# Altium schematic sheet STM32_MPU_IOs.SchDoc: MPU
size A3; SheetNumber: 3; SheetTotal: 7
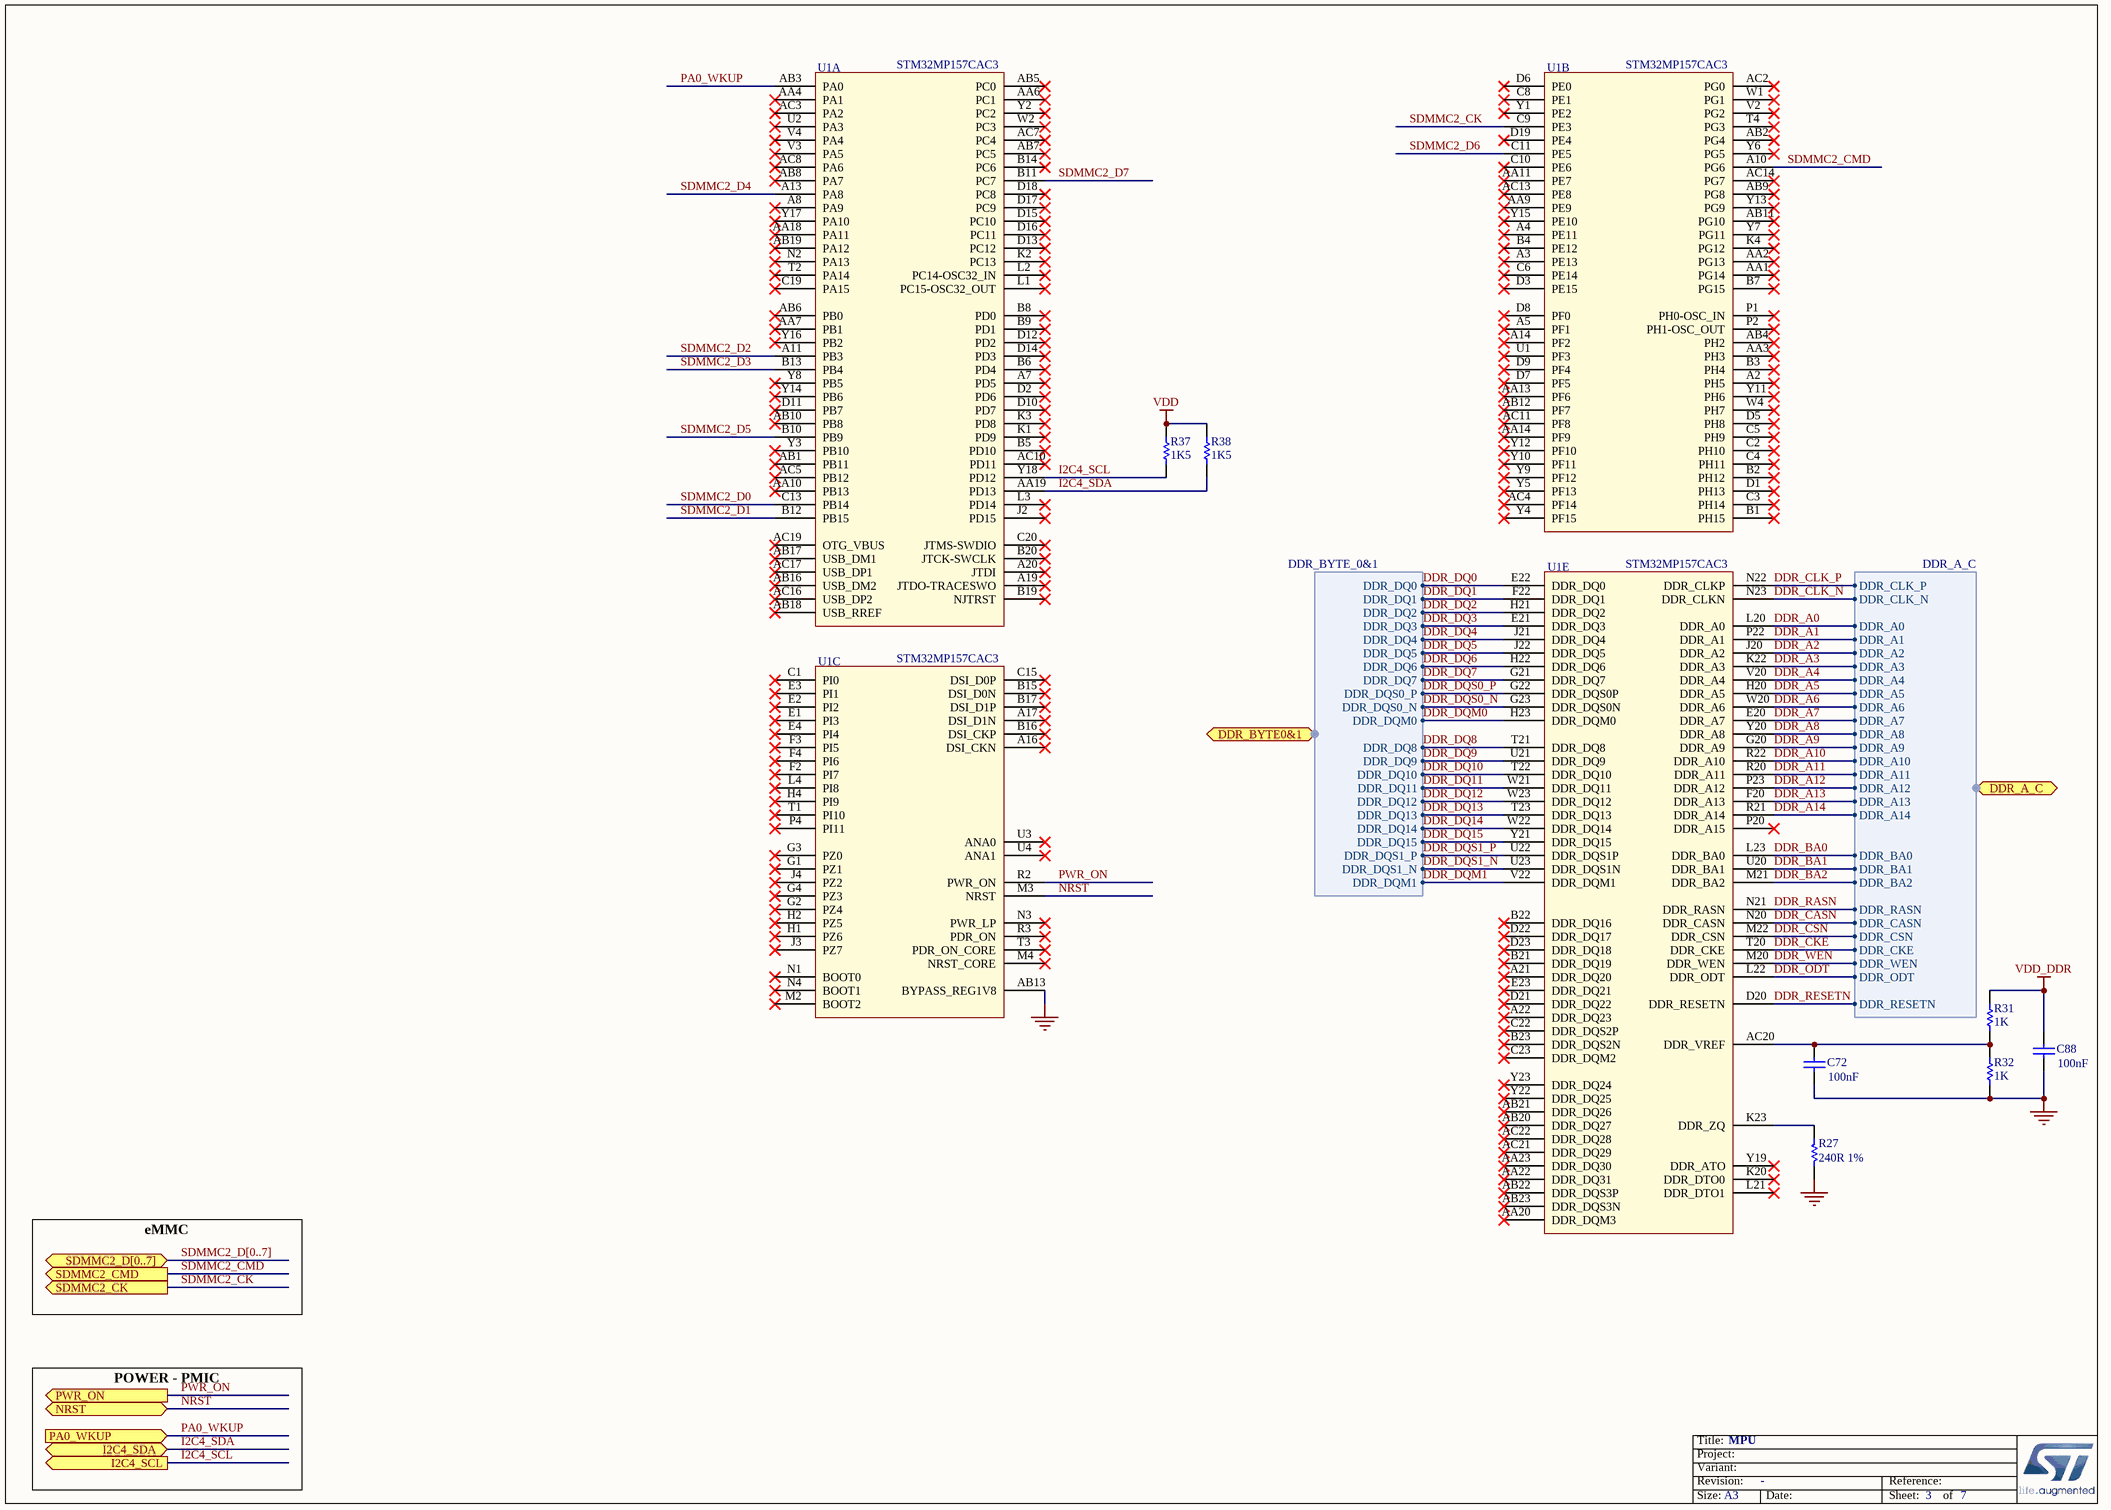
[diagram p0: STM32_MPU_IOs.SchDoc]

## Parts
C72  value 100nF  [C0402]
C88  value 100nF  [C0402]
R27  value 240R 1%  [R0402]
R31  value 1K  [R0402]
R32  value 1K  [R0402]
R37  value 1K5  [R0402]
R38  value 1K5  [R0402]
U1  value STM32MP157CAC3  [ICC_TFBGA361_12X12_STM32MP157CAC3_P050-065]  (parts A,B,C,E of 5)

## Ports
DDR_A_C (harness DDR_A_C), DDR_BYTE0&1 (harness DDR_BYTE_0&1), I2C4_SCL (out), I2C4_SDA (bidir), NRST (bidir), PA0_WKUP (in), PWR_ON (out), SDMMC2_CK (out), SDMMC2_CMD (out), SDMMC2_D[0..7] (bidir)

## Harnesses
DDR_BYTE_0&1: DDR_DQ0, DDR_DQ1, DDR_DQ2, DDR_DQ3, DDR_DQ4, DDR_DQ5, DDR_DQ6, DDR_DQ7, DDR_DQS0_P, DDR_DQS0_N, DDR_DQM0, DDR_DQ8, DDR_DQ9, DDR_DQ10, DDR_DQ11, DDR_DQ12, DDR_DQ13, DDR_DQ14, DDR_DQ15, DDR_DQS1_P, DDR_DQS1_N, DDR_DQM1
DDR_A_C: DDR_CLK_P, DDR_CLK_N, DDR_A0, DDR_A1, DDR_A2, DDR_A3, DDR_A4, DDR_A5, DDR_A6, DDR_A7, DDR_A8, DDR_A9, DDR_A10, DDR_A11, DDR_A12, DDR_A13, DDR_A14, DDR_BA0, DDR_BA1, DDR_BA2, DDR_RASN, DDR_CASN, DDR_CSN, DDR_CKE, DDR_WEN, DDR_ODT, DDR_RESETN

## Nets
GND: C72.1 C88.1 R27.2 R32.1 U1.AB13(BYPASS_REG1V8)
VDD: R37.1 R38.1
VDD_DDR: C88.2 R31.2
DDR_A0: U1.L20(DDR_A0) ; port DDR_A_C.DDR_A0
DDR_A1: U1.P22(DDR_A1) ; port DDR_A_C.DDR_A1
DDR_A2: U1.J20(DDR_A2) ; port DDR_A_C.DDR_A2
DDR_A3: U1.K22(DDR_A3) ; port DDR_A_C.DDR_A3
DDR_A4: U1.V20(DDR_A4) ; port DDR_A_C.DDR_A4
DDR_A5: U1.H20(DDR_A5) ; port DDR_A_C.DDR_A5
DDR_A6: U1.W20(DDR_A6) ; port DDR_A_C.DDR_A6
DDR_A7: U1.E20(DDR_A7) ; port DDR_A_C.DDR_A7
DDR_A8: U1.Y20(DDR_A8) ; port DDR_A_C.DDR_A8
DDR_A9: U1.G20(DDR_A9) ; port DDR_A_C.DDR_A9
DDR_A10: U1.R22(DDR_A10) ; port DDR_A_C.DDR_A10
DDR_A11: U1.R20(DDR_A11) ; port DDR_A_C.DDR_A11
DDR_A12: U1.P23(DDR_A12) ; port DDR_A_C.DDR_A12
DDR_A13: U1.F20(DDR_A13) ; port DDR_A_C.DDR_A13
DDR_A14: U1.R21(DDR_A14) ; port DDR_A_C.DDR_A14
DDR_BA0: U1.L23(DDR_BA0) ; port DDR_A_C.DDR_BA0
DDR_BA1: U1.U20(DDR_BA1) ; port DDR_A_C.DDR_BA1
DDR_BA2: U1.M21(DDR_BA2) ; port DDR_A_C.DDR_BA2
DDR_CASN: U1.N20(DDR_CASN) ; port DDR_A_C.DDR_CASN
DDR_CKE: U1.T20(DDR_CKE) ; port DDR_A_C.DDR_CKE
DDR_CLK_N: U1.N23(DDR_CLKN) ; port DDR_A_C.DDR_CLK_N
DDR_CLK_P: U1.N22(DDR_CLKP) ; port DDR_A_C.DDR_CLK_P
DDR_CSN: U1.M22(DDR_CSN) ; port DDR_A_C.DDR_CSN
DDR_DQ0: U1.E22(DDR_DQ0) ; port DDR_BYTE0&1.DDR_DQ0
DDR_DQ1: U1.F22(DDR_DQ1) ; port DDR_BYTE0&1.DDR_DQ1
DDR_DQ2: U1.H21(DDR_DQ2) ; port DDR_BYTE0&1.DDR_DQ2
DDR_DQ3: U1.E21(DDR_DQ3) ; port DDR_BYTE0&1.DDR_DQ3
DDR_DQ4: U1.J21(DDR_DQ4) ; port DDR_BYTE0&1.DDR_DQ4
DDR_DQ5: U1.J22(DDR_DQ5) ; port DDR_BYTE0&1.DDR_DQ5
DDR_DQ6: U1.H22(DDR_DQ6) ; port DDR_BYTE0&1.DDR_DQ6
DDR_DQ7: U1.G21(DDR_DQ7) ; port DDR_BYTE0&1.DDR_DQ7
DDR_DQ8: U1.T21(DDR_DQ8) ; port DDR_BYTE0&1.DDR_DQ8
DDR_DQ9: U1.U21(DDR_DQ9) ; port DDR_BYTE0&1.DDR_DQ9
DDR_DQ10: U1.T22(DDR_DQ10) ; port DDR_BYTE0&1.DDR_DQ10
DDR_DQ11: U1.W21(DDR_DQ11) ; port DDR_BYTE0&1.DDR_DQ11
DDR_DQ12: U1.W23(DDR_DQ12) ; port DDR_BYTE0&1.DDR_DQ12
DDR_DQ13: U1.T23(DDR_DQ13) ; port DDR_BYTE0&1.DDR_DQ13
DDR_DQ14: U1.W22(DDR_DQ14) ; port DDR_BYTE0&1.DDR_DQ14
DDR_DQ15: U1.Y21(DDR_DQ15) ; port DDR_BYTE0&1.DDR_DQ15
DDR_DQM0: U1.H23(DDR_DQM0) ; port DDR_BYTE0&1.DDR_DQM0
DDR_DQM1: U1.V22(DDR_DQM1) ; port DDR_BYTE0&1.DDR_DQM1
DDR_DQS0_N: U1.G23(DDR_DQS0N) ; port DDR_BYTE0&1.DDR_DQS0_N
DDR_DQS0_P: U1.G22(DDR_DQS0P) ; port DDR_BYTE0&1.DDR_DQS0_P
DDR_DQS1_N: U1.U23(DDR_DQS1N) ; port DDR_BYTE0&1.DDR_DQS1_N
DDR_DQS1_P: U1.U22(DDR_DQS1P) ; port DDR_BYTE0&1.DDR_DQS1_P
DDR_ODT: U1.L22(DDR_ODT) ; port DDR_A_C.DDR_ODT
DDR_RASN: U1.N21(DDR_RASN) ; port DDR_A_C.DDR_RASN
DDR_RESETN: U1.D20(DDR_RESETN) ; port DDR_A_C.DDR_RESETN
DDR_WEN: U1.M20(DDR_WEN) ; port DDR_A_C.DDR_WEN
I2C4_SCL: R37.2 U1.Y18(PD12) ; port I2C4_SCL
I2C4_SDA: R38.2 U1.AA19(PD13) ; port I2C4_SDA
NRST: U1.M3(NRST) ; port NRST
PA0_WKUP: U1.AB3(PA0) ; port PA0_WKUP
PWR_ON: U1.R2(PWR_ON) ; port PWR_ON
SDMMC2_CK: U1.C9(PE3) ; port SDMMC2_CK
SDMMC2_CMD: U1.A10(PG6) ; port SDMMC2_CMD
SDMMC2_D0: U1.C13(PB14)
SDMMC2_D1: U1.B12(PB15)
SDMMC2_D2: U1.A11(PB3)
SDMMC2_D3: U1.B13(PB4)
SDMMC2_D4: U1.A13(PA8)
SDMMC2_D5: U1.B10(PB9)
SDMMC2_D6: U1.C11(PE5)
SDMMC2_D7: U1.B11(PC7)
NetC72_2: C72.2 R31.1 R32.2 U1.AC20(DDR_VREF)
NetR27_1: R27.1 U1.K23(DDR_ZQ)

Not connected (* = marked no-connect by the designer): U1 A2(PH5)* A3(PE13)* A4(PE11)* A5(PF1)* A7(PD5)* A8(PA9)* A14(PF2)* A16(DSI_CKN)* A17(DSI_D1N)* A19(JTDO-TRACESWO)* A20(JTDI)* A21(DDR_DQ20)* A22(DDR_DQ23)* AA1(PG14)* AA2(PG13)* AA3(PH3)* AA4(PA1)* AA6(PC1)* AA7(PB1)* AA9(PE9)* AA10(PB13)* AA11(PE7)* AA13(PF6)* AA14(PF9)* AA18(PA11)* AA20(DDR_DQM3)* AA22(DDR_DQ31)* AA23(DDR_DQ30)* AB1(PB11)* AB2(PG4)* AB4(PH2)* AB5(PC0)* AB6(PB0)* AB7(PC5)* AB8(PA7)* AB9(PG8)* AB10(PB8)* AB11(PG10)* AB12(PF7)* AB16(USB_DM2)* AB17(USB_DM1)* AB18(USB_RREF)* AB19(PA12)* AB20(DDR_DQ27)* AB21(DDR_DQ26)* AB22(DDR_DQS3P)* AB23(DDR_DQS3N)* AC2(PG0)* AC3(PA2)* AC4(PF14)* AC5(PB12)* AC7(PC4)* AC8(PA6)* AC10(PD11)* AC11(PF8)* AC13(PE8)* AC14(PG7)* AC16(USB_DP2)* AC17(USB_DP1)* AC19(OTG_VBUS)* AC21(DDR_DQ29)* AC22(DDR_DQ28)* B1(PH15)* B2(PH12)* B3(PH4)* B4(PE12)* B5(PD10)* B6(PD4)* B7(PG15)* B8(PD0)* B9(PD1)* B14(PC6)* B15(DSI_D0N)* B16(DSI_CKP)* B17(DSI_D1P)* B19(NJTRST)* B20(JTCK-SWCLK)* B21(DDR_DQ19)* B22(DDR_DQ16)* B23(DDR_DQS2N)* C1(PI0)* C2(PH10)* C3(PH14)* C4(PH11)* C5(PH9)* C6(PE14)* C8(PE1)* C10(PE6)* C15(DSI_D0P)* C19(PA15)* C20(JTMS-SWDIO)* C22(DDR_DQS2P)* C23(DDR_DQM2)* D1(PH13)* D2(PD6)* D3(PE15)* D5(PH8)* D6(PE0)* D7(PF5)* D8(PF0)* D9(PF4)* D10(PD7)* D11(PB7)* D12(PD2)* D13(PC12)* D14(PD3)* D15(PC10)* D16(PC11)* D17(PC9)* D18(PC8)* D19(PE4)* D21(DDR_DQ22)* D22(DDR_DQ17)* D23(DDR_DQ18)* E1(PI3)* E2(PI2)* E3(PI1)* E4(PI4)* E23(DDR_DQ21)* F2(PI7)* F3(PI5)* F4(PI6)* G1(PZ1)* G2(PZ4)* G3(PZ0)* G4(PZ3)* H1(PZ6)* H2(PZ5)* H4(PI9)* J2(PD15)* J3(PZ7)* J4(PZ2)* K1(PD9)* K2(PC13)* K3(PD8)* K4(PG12)* K20(DDR_DTO0)* L1(PC15-OSC32_OUT)* L2(PC14-OSC32_IN)* L3(PD14)* L4(PI8)* L21(DDR_DTO1)* M2(BOOT2)* M4(NRST_CORE)* N1(BOOT0)* N2(PA13)* N3(PWR_LP)* N4(BOOT1)* P1(PH0-OSC_IN)* P2(PH1-OSC_OUT)* P4(PI11)* P20(DDR_A15)* R3(PDR_ON)* T1(PI10)* T2(PA14)* T3(PDR_ON_CORE)* T4(PG3)* U1(PF3)* U2(PA3)* U3(ANA0)* U4(ANA1)* V2(PG2)* V3(PA5)* V4(PA4)* W1(PG1)* W2(PC3)* W4(PH7)* Y1(PE2)* Y2(PC2)* Y3(PB10)* Y4(PF15)* Y5(PF13)* Y6(PG5)* Y7(PG11)* Y8(PB5)* Y9(PF12)* Y10(PF11)* Y11(PH6)* Y12(PF10)* Y13(PG9)* Y14(PB6)* Y15(PE10)* Y16(PB2)* Y17(PA10)* Y19(DDR_ATO)* Y22(DDR_DQ25)* Y23(DDR_DQ24)*

## Buses and harness runs
bus SDMMC2_D[0..7] = port SDMMC2_D[0..7]

## Notes on the sheet
- eMMC
- POWER - PMIC
- Title:
- Project:
- Size:
- Revision:
- Variant:
- A3
- -
- Date:
- Reference:
- Sheet:
- of

## Library data of the parts
C72 C88 = MCD-00006: Capacitor, MLCC, 100nF, 16V, X7R, 10%, 0402, T=0.5mm; Manufacturer_Part_Number: CC0402KRX7R7BB104; Manufacturer: YAGEO; Alternate_Manufacturer_Part_Number: GCM155R71C104KA55D; Alternate_Manufacturer: MURATA; ECCN_US: EAR99; ECCN_EU: NEC; Provided_By: SUBCO; Internal_Part_Number: MCD-00006; ComponentLink1Description: Datasheet; Status: Released; Part_Type: Capacitor; Package: C0402; ComponentLink1URL: http://tunmcdsvn.tun.st.com/Component_Datasheet_Library/Trunk/Capacitors/Yageo_Multilayer_Capacitor_X7R_series_100pF_to_22uF
R27 = MCD-00120: Resistor,240R,0402,1%,1/16W; Manufacturer_Part_Number: RC0402FR-07240RL; Manufacturer: YAGEO; ECCN_US: EAR99; ECCN_EU: NEC; Provided_By: SUBCO; Internal_Part_Number: MCD-00120; ComponentLink1Description: Datasheet; Status: Released; Part_Type: Resistor; ComponentLink1URL: http://tunmcdsvn.tun.st.com/Component_Datasheet_Library/Trunk/Resistors/Yageo_Resistor_RC0402-series; Package: R0402
R31 R32 = MCD-00061: Resistor,1K,0402,1%,1/16W; Manufacturer_Part_Number: RC0402FR-071KL; Manufacturer: YAGEO; Provided_By: SUBCO; ECCN_US: EAR99; ECCN_EU: NEC; Internal_Part_Number: MCD-00061; Status: Released; Part_Type: Resistor; Package: R0402; ComponentLink1Description: Datasheet; ComponentLink1URL: http://tunmcdsvn.tun.st.com/Component_Datasheet_Library/Trunk/Resistors/Yageo_Resistor_RC0402-series
R37 R38 = MCD-00068: Resistor,1K5,0402,1%,1/16W; Manufacturer_Part_Number: RC0402FR-071K5L; Manufacturer: YAGEO; ECCN_US: EAR99; ECCN_EU: NEC; Provided_By: SUBCO; Internal_Part_Number: MCD-00068; ComponentLink1Description: Datasheet; Status: Released; Part_Type: Resistor; ComponentLink1URL: http://tunmcdsvn.tun.st.com/Component_Datasheet_Library/Trunk/Resistors/Yageo_Resistor_RC0402-series; Package: R0402
U1 = MCD-00677: MPU TFBGA12x12 secure boot+crypto; Part_Type: IC; Manufacturer: STMICROELECTRONICS; BMS_Part_Number: 9175503; ECCN_US: 5A002A4; ECCN_EU: NEC; Provided_By: SUBCO with ST control; Internal_Part_Number: MCD-00677; Status: Footprint available; Manufacturer_Part_Number: STM32MP157CAC3; ComponentLink1Description: Datasheet; ComponentLink1URL: http://tunmcdsvn.tun.st.com/Component_Datasheet_Library/Trunk/IC/STM_MPU_12x12_POA_DM00342580_POA12x12